# EAGLE design TMP006 (EAGLE 6.3)
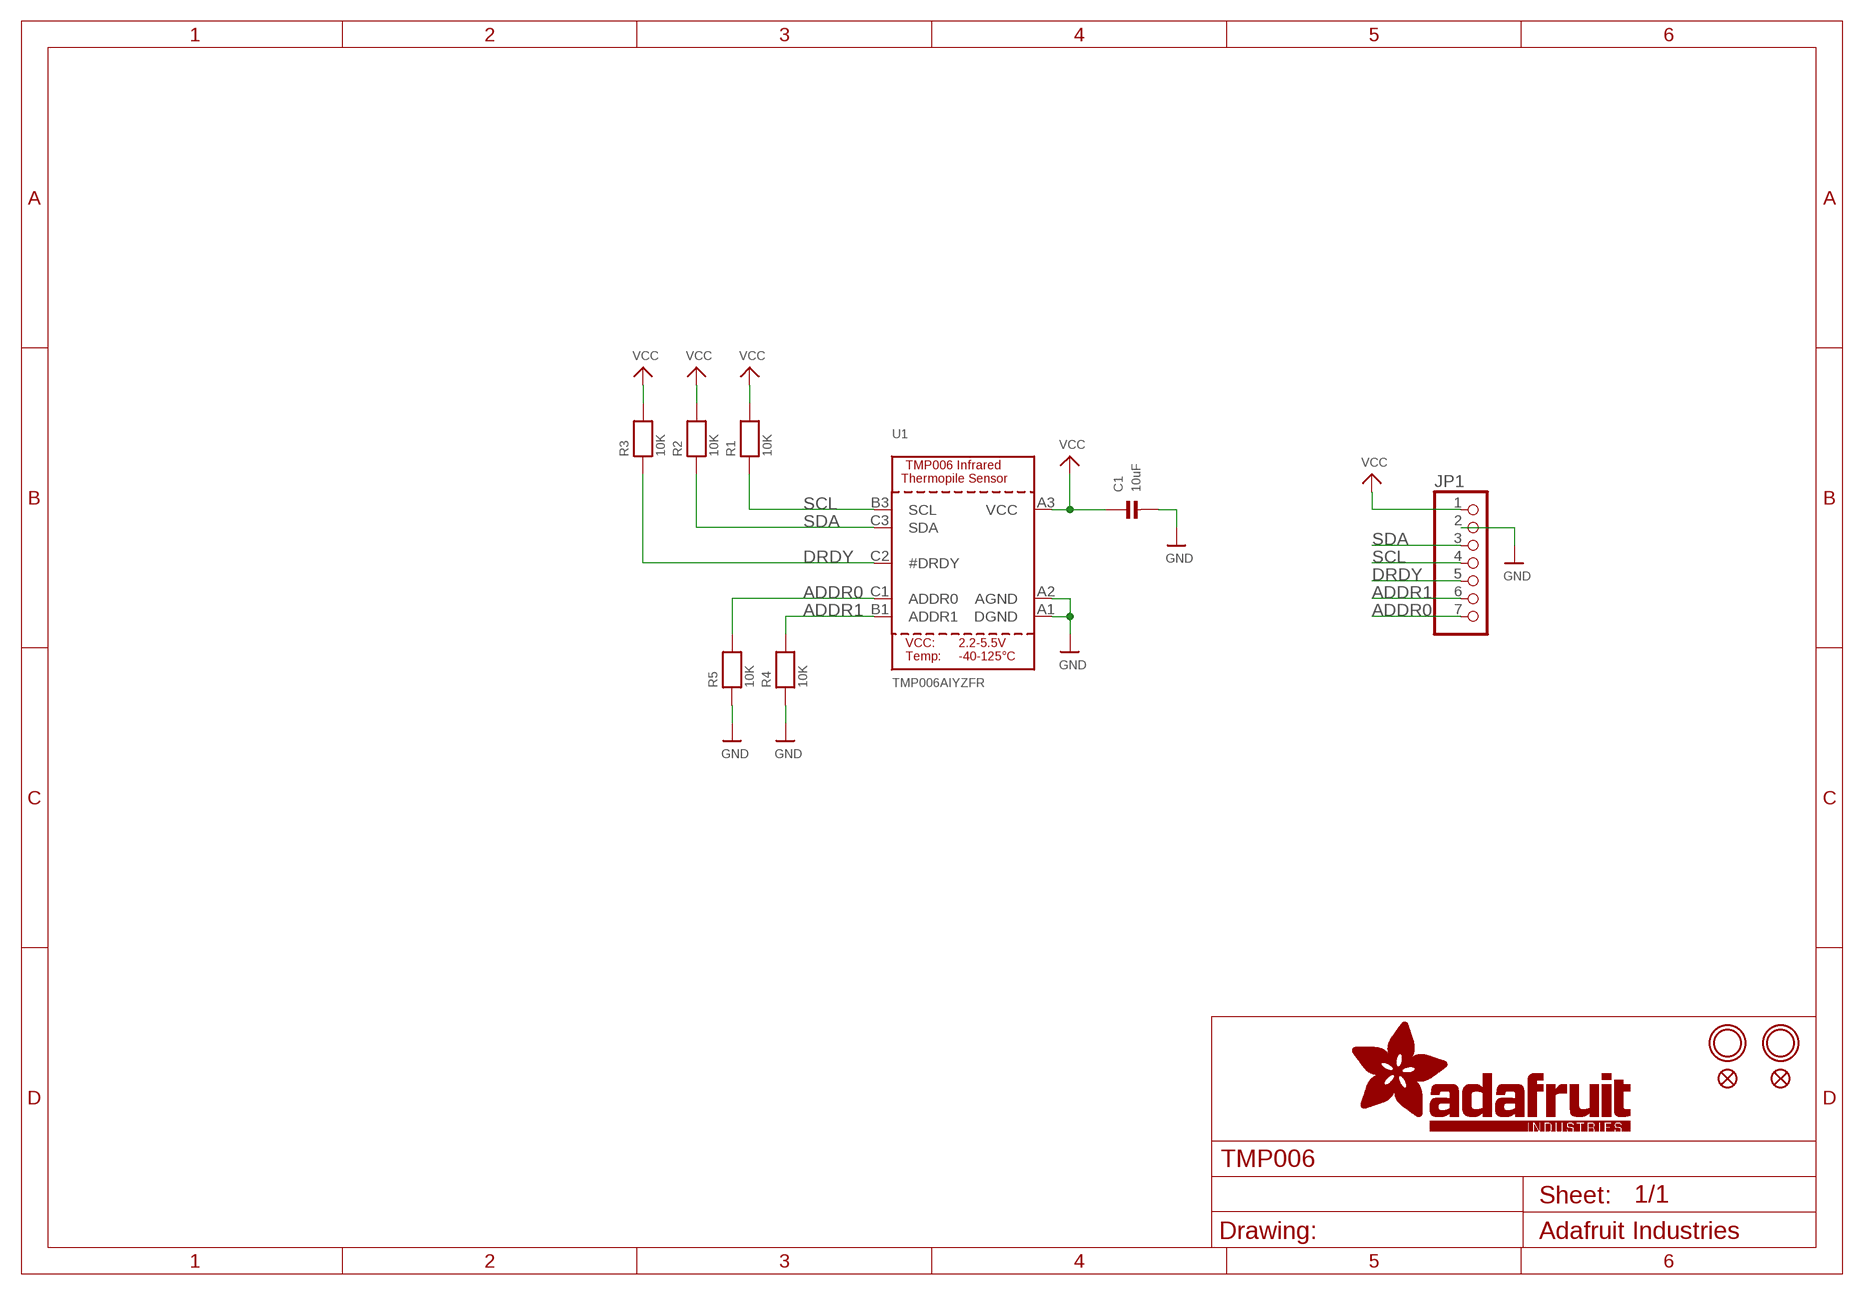
[diagram p0: schematic, sheet 1]

## Parts
C1  10uF  CAP_CERAMIC0805  [0805]
FID1  FIDUCIAL""  [FIDUCIAL_1MM]
FID2  FIDUCIAL""  [FIDUCIAL_1MM]
JP1  HEADER-1X7THICKER  [1X07_ROUND_76]
R1  10K  RESISTOR0805  [0805]
R2  10K  RESISTOR0805  [0805]
R3  10K  RESISTOR0805  [0805]
R4  10K  RESISTOR0805  [0805]
R5  10K  RESISTOR0805  [0805]
U1  TMP006AIYZFR  TMP006  [WCSP-8]
U$6  MOUNTINGHOLE2.5  [MOUNTINGHOLE_2.5_PLATED]
U$7  MOUNTINGHOLE2.5  [MOUNTINGHOLE_2.5_PLATED]

## Nets
ADDR0: JP1.7 R5.2 U1.C1(ADDR0)
ADDR1: JP1.6 R4.2 U1.B1(ADDR1)
DRDY: JP1.5 R3.1 U1.C2(#DRDY)
GND: C1.2 JP1.2 R4.1 R5.1 U1.A1(DGND) U1.A2(AGND)
SCL: JP1.4 R1.1 U1.B3(SCL)
SDA: JP1.3 R2.1 U1.C3(SDA)
VCC: C1.1 JP1.1 R1.2 R2.2 R3.2 U1.A3(VCC)

## Library data of the parts
C1 = microbuilder:CAP_CERAMIC: Ceramic Capacitors 0402 - 0402 Surface Mount Capacitors 16pF 50V 5% [Digikey: 445-4899-2-ND] 18pF 50V 5% [Digikey: 490-1281-2-ND] 22pF 50V 5% [Digikey: 490-1283-2-ND] 68pF 50V 5% [Digikey: 490-1289-2-ND] 0.1uF 10V 10% [Digikey: 490-1318-2-ND] 1.0uF 6.3V 10% [Digikey: 490-1320-2-ND] 0603 - 0603 Surface Mount Capacitors 16 pF 50V 5% [Digikey: 445-5051-2-ND] 22 pF 50V [Digikey: PCC220ACVTR-ND] 33 pF 50V 5% [Digikey: 490-1415-1-ND] 56pF 50V 5% [Digikey: 490-1421-1-ND] 220pF 50V 5% [Digikey: 445-1285-1-ND] 680 pF 50V 2200 pF 50V 5% C0G [Digikey: 445-1297-1-ND] 5600 pF 100V 5% X7R [Digikey: 478-3711-1-ND] 0.1 µF 25V 10% [Digikey: PCC2277TR-ND] 0.22 µF 16V 10% X7R [Digikey: 445-1318-1-ND] 1.0 µF 25V 10% [Digikey: 445-5146-2-ND] 0603 - RF Specific 3pF 250V +/-0.1pF RF [Digikey: 712-1347-1-ND] 18 pF 250V 5% [Digikey: 478-3505-1-ND or 712-1322-1-ND] 56 pF 250V 5% C0G RF [Digikey: 490-4867-1-ND] 68 pF 250V RF [Digikey: 490-4868-1-ND] 0805 - 0805 Surface Mount Capacitors 220 pF 250V 2% RF Ceramic Capacitor [Digikey: 712-1398-1-ND] 1000 pF 50V 2% NP0 Ceramic Capacitor [Digikey: 478-3760-1-ND] 0.1 µF 25V 10% Ceramic Capacitor [Digikey: PCC1828TR-ND] 1.0 µF 16V 10% Ceramic Capacitor[Digikey: 490-1691-2-ND] 10.0 µF 10V 10% Ceramic Capacitor[Digikey: 709-1228-1-ND] 10.0 uF 16V 10% Ceramic Capacitor [Digikey: 478-5165-2-ND] 47 uF 6.3V 20% Ceramic Capacitor [Digikey: 587-1779-1-ND or 399-5506-1-ND] 1206 - 1206 Surface Mount Capacitors 47uF 10V 20% Ceramic Capacitor [Digikey: 490-5528-1-ND or 399-5508-1-ND or 445-6010-1-ND] 100uF 6.3V -20%, +80% Y5V Ceramic Capacitor (Digikey: 490-4512-1-ND, Mouser: 81-GRM31CF50J107ZE1L)
FID1 FID2 = microbuilder:FIDUCIAL: Fiducial Alignment Points Various fiducial points for machine vision alignment.
JP1 = microbuilder:HEADER-1X7: PIN HEADER
R1-R5 = microbuilder:RESISTOR: Resistors 0402 - 0402 Surface Mount Package 22 Ohm 1% 1/16W [Digikey: 311-22.0LRTR-ND] 33 Ohm 5% 1/16W 1.0K 5% 1/16W 1.5K 5% 1/16W 2.0K 1% 1/16W 10.0K 1% 1/16W [Digikey: 311-10.0KLRTR-ND] 10.0K 5% 1/16W [Digikey: RMCF0402JT10K0TR-ND] 12.1K 1% 1/16W [Digikey: 311-22.0LRTR-ND] 100.0K 5% 1/16W 0603 - 0603 Surface Mount Package 0 Ohm 1/10 Watt 1% Resistor 15 Ohm 1/10 Watt 1% Resistor 33 Ohm 1/10 Watt 1% Resistor 49.9 Ohm 1/10 Watt 1% Resistor 100 Ohm 1/10 Watt 1% Resistor 150 Ohm 1/10 Watt 1% Resistor 240 Ohm 1/10 Watt 1% Resistor 390 Ohm 1/10 Watt 1% Resistor 560 Ohm 1/10 Watt 1% Resistor 680 Ohm 1/10 Watt 1% Resistor 750 Ohm 1/10 Watt 1% Resistor 1.0K Ohm 1/10 Watt 1% Resistor 1.5K Ohm 1/10 Watt 1% Resistor 2.0K Ohm 1/10 Watt 1% Resistor 2.2K Ohm 1/10 Watt 1% Resistor 3.3K Ohm 1/10 Watt 1% Resistor 4.7K Ohm 1/10 Watt 1% Resistor 10.0K Ohm 1/10 Watt 1% Resistor 12.0K Ohm 1/10 Watt 1% Resistor 12.1K Ohm 1/10 Watt 1% Resistor 20.0K Ohm 1/10 Watt 1% Resistor 33.0K Ohm 1/10 Watt 1% Resistor 100.0K Ohm 1/10 Watt 1% Resistor 0805 - 0805 Surface Mount Package 0 Ohm 1/8 Watt 1% Resistor 33 Ohm 1/8 Watt 1% Resistor 100 Ohm 1/8 Watt 1% Resistor 150 Ohm 1/8 Watt 1% Resistor 200 Ohm 1/8 Watt 1% Resistor 240 Ohm 1/8 Watt 1% Resistor 330 Ohm 1/8 Watt 1% Resistor 390 Ohm 1/8 Watt 1% Resistor 470 Ohm 1/8 Watt 1% Resistor 1.0K Ohm 1/8 Watt 1% Resistor 1.5K Ohm 1/8 Watt 1% Resistor 2.0K Ohm 1/8 Watt 1% Resistor 4.7K Ohm 1/8 Watt 1% Resistor 5.1K Ohm 1/8 Watt 1% Resistor 5.6K Ohm 1/8 Watt 1% Resistor 10.0K Ohm 1/8 Watt 1% Resistor 22.0K Ohm 1/8 Watt 1% Resistor 33.0K Ohm 1/8 Watt 1% Resistor 100K Ohm 1/8 Watt 1% Resistor 1206 - 1206 Surface Mount Package 2012 - 2010 Surface Mount Package 0.11 Ohm 1/2 Watt 1% Resistor - Digikey: RHM.11UCT-ND
U1 = microbuilder:TMP006: TMP006 Infrared Thermopile Sensor Sensor Voltage: 7 μV/°C Infrared Sensor Range: –40°C to +125°C Source: http://www.ti.com/lit/ds/sbos518b/sbos518b.pdf
U$6 U$7 = microbuilder:MOUNTINGHOLE: Mounting Hole For #2 screws (0.086"/2.18mm width, 0.094"/2.4mm hole) use 2.5mm

## Board
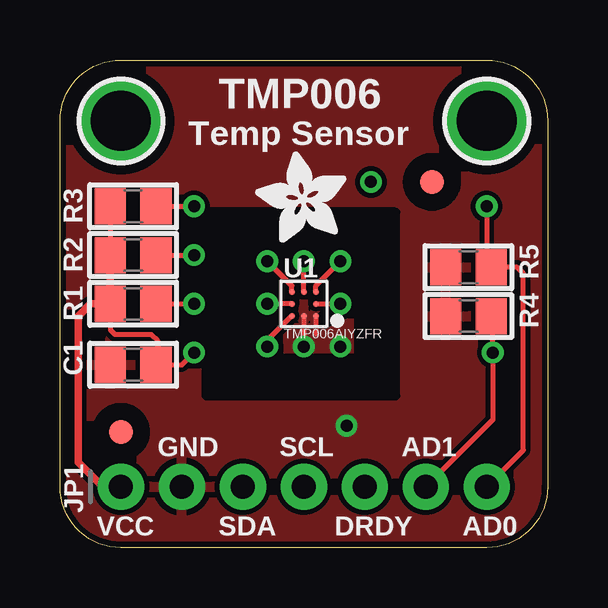
[diagram p1: board, top side]
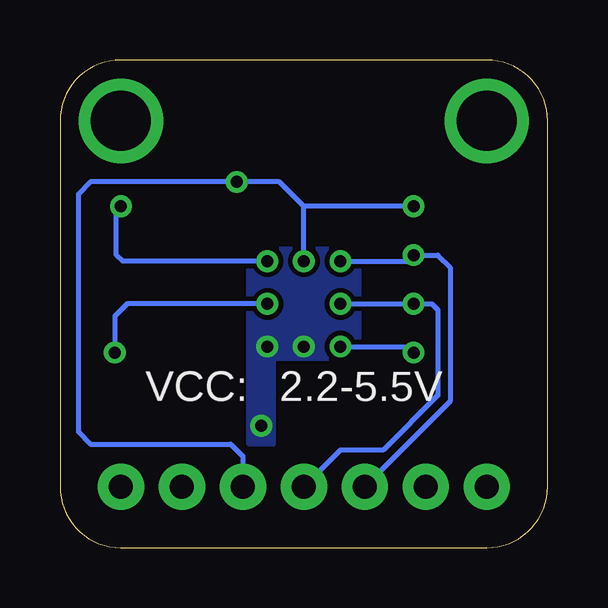
[diagram p2: board, bottom side, seen from below]

Size 20.32 x 20.32 mm. Coordinates in mm from the lower left corner, seen from the top.
Outline: 0,17.78 arc-90 2.54,20.32 17.78,20.32 arc-90 20.32,17.78 20.32,2.54 arc-90 17.78,0 2.54,0 arc-90 0,2.54 0,17.78
Copper layers (1*16): Top 0.035mm / dielectric 1.5mm / Bottom 0.035mm
Design rules "adafruit": minimum track width 8mil, minimum drill 16mil, track to track 8mil, track to pad 8mil, pad to pad 8mil, via to via 8mil, smd to smd 8mil, copper to edge 10mil, drill to drill 8mil, minimum pad ring 10mil, minimum via ring 8mil, stop-mask expansion 4mil, vias tented up to drill 20mil, thermal gap 10mil
tRestrict: area 12.4,6.3 to 14,14; area 6.1,6.3 to 7.9,14; area 7.9,12.4 to 12.4,14; area 7.9,6.3 to 12.4,7.9; area 10.9,9.4 to 11.2,9.7

### Footprints (pad centres in the part's own frame; a part is rotated, then mirrored left to right if it is on the bottom)
0805 = smd 1.3 x 1.5: 1 -0.95,0; 2 0.95,0
FIDUCIAL_1MM = smd 1 x 1: 1 0,0
1X07_ROUND_76 = drill 1 pad 1.93: 1 -7.62,0; 2 -5.08,0; 3 -2.54,0; 4 0,0; 5 2.54,0; 6 5.08,0; 7 7.62,0
WCSP-8 = smd 0.25 x 0.25: A1 0.5,-0.5; A2 0,-0.5; A3 -0.5,-0.5; B1 0.5,0; B3 -0.5,0; C1 0.5,0.5; C2 0,0.5; C3 -0.5,0.5
MOUNTINGHOLE_2.5_PLATED = drill 2.5 pad 3.2: P$1 0,0

### Placement (x,y rotation side)
C1  3.05,7.62 180 top
FID1  2.54,4.83 0 top
FID2  15.49,15.24 0 top
JP1  10.16,2.54 0 top
R1  3.05,10.16 180 top
R2  3.05,12.19 180 top
R3  3.05,14.22 180 top
R4  17.02,9.65 0 top
R5  17.02,11.68 0 top
U1  10.16,10.16 0 top
U$6  17.78,17.78 0 top
U$7  2.54,17.78 0 top
U$9  [ADAFRUIT_3.5MM]  11.94,12.7 90 top

### Tracks (layer width: path | path; a pad name or v marks a point on that pad's centre or on a via)
ADDR0  (via drill 0.5)
  Top 0.203: U1.C1 10.66,10.91 v11.68,11.94 | v17.78,14.22 17.78,11.87 R5.2 19.05,11.68 19.3,11.43 19.3,4.06 JP1.7
  Bottom 0.203: v11.68,11.94 17.71,11.94 17.97,12.19 17.97,14.04 v17.78,14.22
ADDR1  (via drill 0.5)
  Top 0.203: U1.B1 v11.68,10.16 | R4.2 18.03,9.59 v18.03,8.13 18.03,5.33 JP1.6
  Bottom 0.203: v11.68,10.16 17.53,10.16 18.03,9.65 v18.03,8.13
DRDY  (via drill 0.5)
  Top 0.203: U1.C2 v10.16,11.94 | R3.1 v5.59,14.22
  Bottom 0.203: v10.16,11.94 10.16,14.22 | 10.16,14.22 11.18,15.24 v12.95,15.24 19.05,15.24 19.56,14.73 19.56,4.83 19.05,4.32 13.21,4.32 12.7,3.81 JP1.5 | v5.59,14.22 10.16,14.22
GND  (via drill 0.5)
  Top 0.203: U1.A2 v10.16,8.38 | U1.A1 10.66,8.9
  Bottom 0.203: v10.16,8.38 10.16,8.13
  other vias: 11.68,8.38 11.94,5.08
  pour Bottom (isolate 0.203): 7.87,12.45 7.87,7.87 11.43,7.87 11.43,4.32 12.45,4.32 12.45,12.45
  pour Top (isolate 0.203): 0,0 0,20.32 20.32,20.32 20.32,0
  pour Top: 10.08,10.24 10.24,10.24 10.24,9.8 10.16,9.73 10.08,9.8
SCL  (via drill 0.5)
  Top 0.203: U1.B3 v8.64,10.16 | R1.1 v5.59,10.16
  Bottom 0.203: v8.64,10.16 v5.59,10.16 4.83,10.16 4.57,9.91 4.57,6.35 6.86,4.06 8.64,4.06 JP1.4
SDA  (via drill 0.5)
  Top 0.203: U1.C3 9.66,10.91 v8.64,11.94 | R2.1 v5.59,12.19
  Bottom 0.203: v8.64,11.94 5.84,11.94 v5.59,12.19 4.57,12.19 4.06,11.68 4.06,6.1 JP1.3
VCC  (via drill 0.5)
  Top 0.203: U1.A3 8.64,8.64 v8.64,8.38 | R1.2 2.1,9.08 2.29,8.89 3.81,8.89 4.06,8.64 4.06,7.69 C1.1 5.08,7.62 v5.59,8.13 | R3.2 R2.2
  Top 0.305: R2.2 R1.2 1.27,10.16 0.76,9.65 0.76,3.56 1.78,2.54 JP1.1
  Bottom 0.203: v8.64,8.38 5.84,8.38 v5.59,8.13

### Text on the board
tPlace: TMP006 | Temp Sensor | GND | SCL | AD1 | VCC | SDA | DRDY | AD0
bPlace: 2.2-5.5V | VCC: